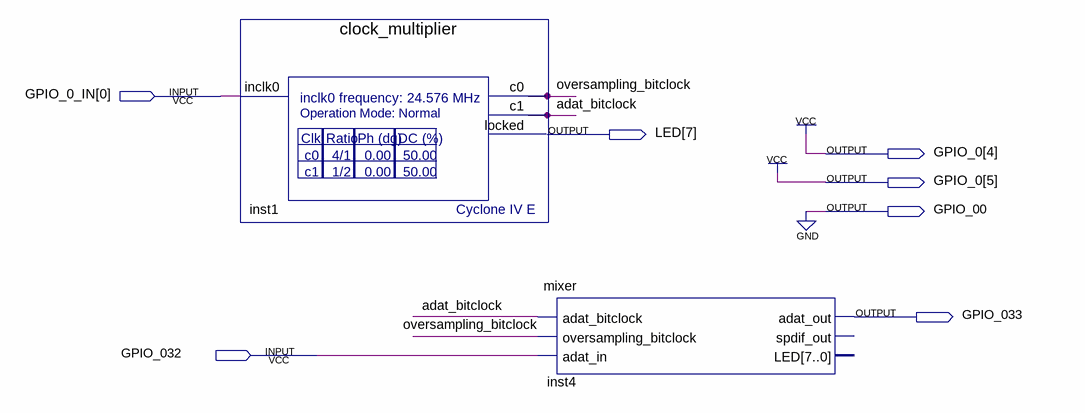
[diagram p0: schematic sheet]
// Quartus schematic nanomixer.bdf as structural Verilog: 2 symbols, 7 pins
module nanomixer (
  input  [0:0] GPIO_0_IN,
  input  GPIO_032,
  output [7:7] LED,
  output [5:4] GPIO_0,
  output GPIO_00,
  output GPIO_033
);

  wire adat_bitclock, oversampling_bitclock;

  clock_multiplier inst1 (.inclk0(GPIO_0_IN[0]), .c0(oversampling_bitclock), .c1(adat_bitclock), .locked(LED[7]));
  mixer inst4 (
    .adat_bitclock(adat_bitclock), .oversampling_bitclock(oversampling_bitclock), .adat_in(GPIO_032),
    .adat_out(GPIO_033));  // open: spdif_out, LED

  assign GPIO_0 = 2'b11;
  assign GPIO_00 = 1'b0;
endmodule
